# EAGLE design placa (EAGLE 9.2.2)
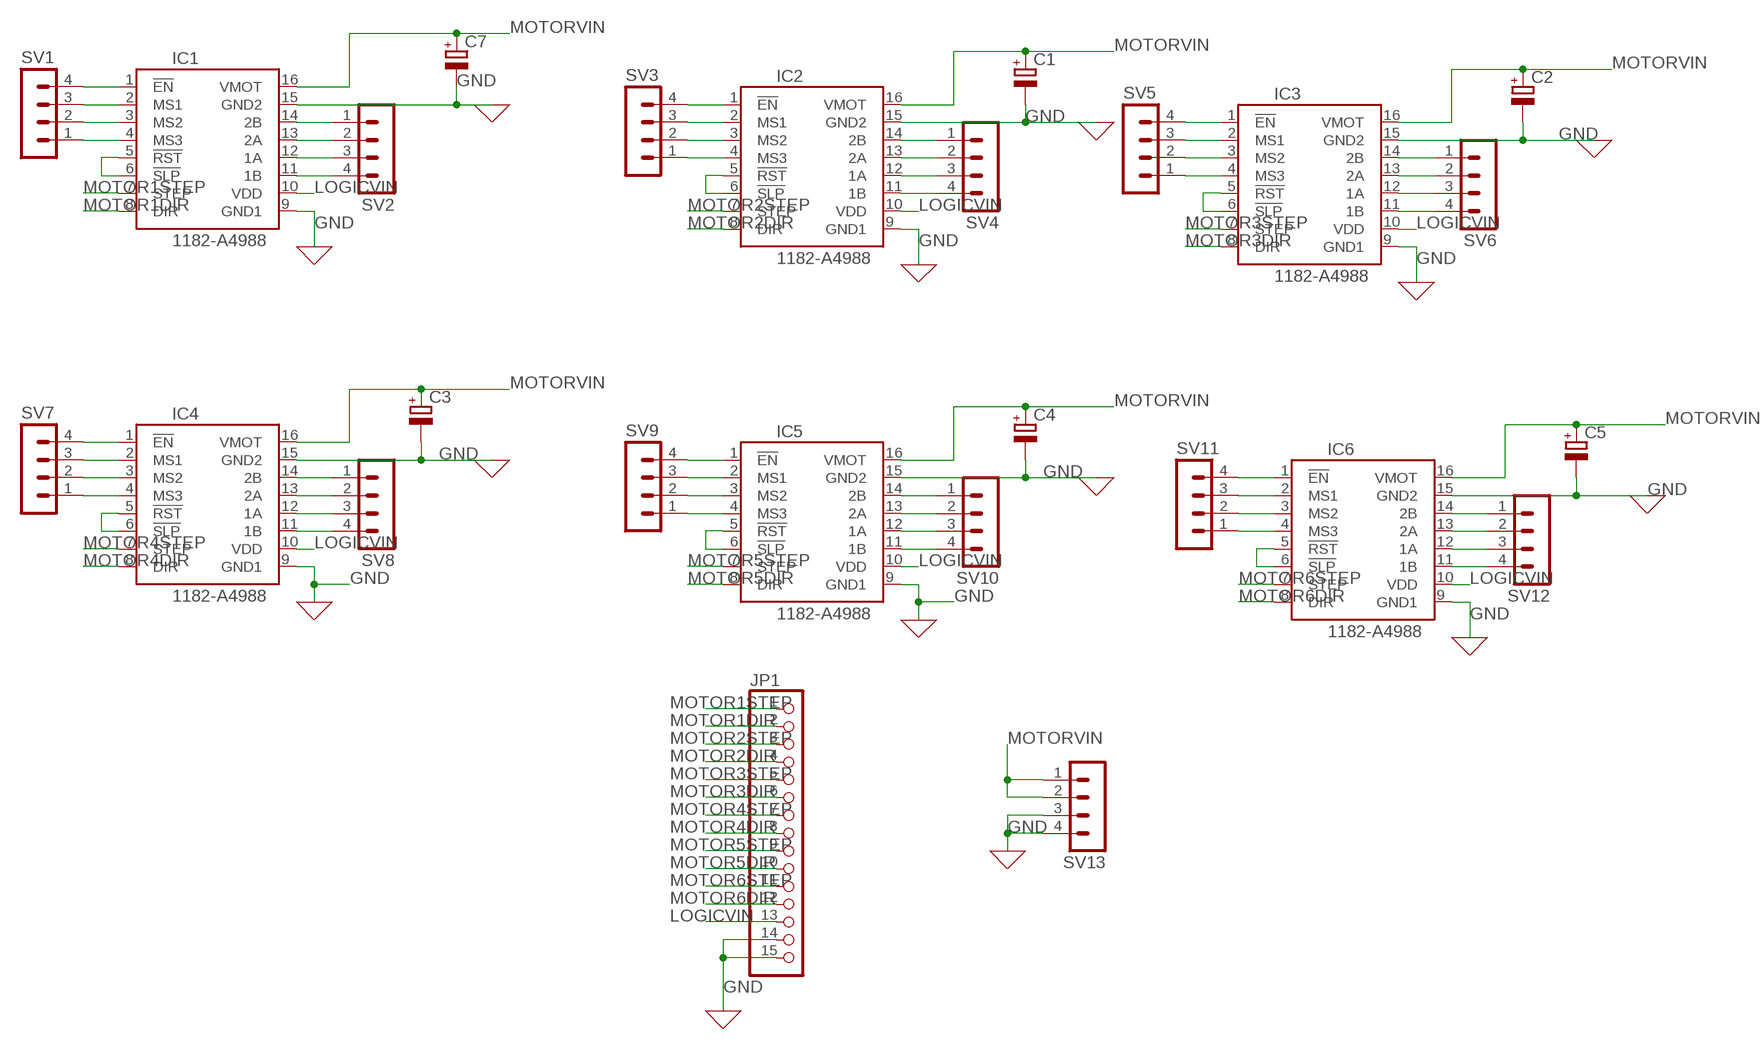
[diagram p0: schematic, sheet 1]

## Parts
C1  CPOL-EUE2.5-7  [E2,5-7]
C2  CPOL-EUE2.5-7  [E2,5-7]
C3  CPOL-EUE2.5-7  [E2,5-7]
C4  CPOL-EUE2.5-7  [E2,5-7]
C5  CPOL-EUE2.5-7  [E2,5-7]
C7  CPOL-EUE2.5-7  [E2,5-7]
IC1  1182-A4988  [A4988]
IC2  1182-A4988  [A4988]
IC3  1182-A4988  [A4988]
IC4  1182-A4988  [A4988]
IC5  1182-A4988  [A4988]
IC6  1182-A4988  [A4988]
JP1  PINHD-1X15  [1X15]
SV1  MA04-1  [MA04-1]
SV2  MA04-1  [MA04-1]
SV3  MA04-1  [MA04-1]
SV4  MA04-1  [MA04-1]
SV5  MA04-1  [MA04-1]
SV6  MA04-1  [MA04-1]
SV7  MA04-1  [MA04-1]
SV8  MA04-1  [MA04-1]
SV9  MA04-1  [MA04-1]
SV10  MA04-1  [MA04-1]
SV11  MA04-1  [MA04-1]
SV12  MA04-1  [MA04-1]
SV13  MA04-1  [MA04-1]

## Nets
GND: C1.- C2.- C3.- C4.- C5.- C7.- IC1.9(GND1) IC1.15(GND2) IC2.9(GND1) IC2.15(GND2) IC3.9(GND1) IC3.15(GND2) IC4.9(GND1) IC4.15(GND2) IC5.9(GND1) IC5.15(GND2) IC6.9(GND1) IC6.15(GND2) JP1.14 JP1.15 SV13.3 SV13.4
LOGICVIN: IC1.10(VDD) IC2.10(VDD) IC3.10(VDD) IC4.10(VDD) IC5.10(VDD) IC6.10(VDD) JP1.13
MOTOR1DIR: IC1.8(DIR) JP1.2
MOTOR1STEP: IC1.7(STEP) JP1.1
MOTOR2DIR: IC2.8(DIR) JP1.4
MOTOR2STEP: IC2.7(STEP) JP1.3
MOTOR3DIR: IC3.8(DIR) JP1.6
MOTOR3STEP: IC3.7(STEP) JP1.5
MOTOR4DIR: IC4.8(DIR) JP1.8
MOTOR4STEP: IC4.7(STEP) JP1.7
MOTOR5DIR: IC5.8(DIR) JP1.10
MOTOR5STEP: IC5.7(STEP) JP1.9
MOTOR6DIR: IC6.8(DIR) JP1.12
MOTOR6STEP: IC6.7(STEP) JP1.11
MOTORVIN: C1.+ C2.+ C3.+ C4.+ C5.+ C7.+ IC1.16(VMOT) IC2.16(VMOT) IC3.16(VMOT) IC4.16(VMOT) IC5.16(VMOT) IC6.16(VMOT) SV13.1 SV13.2
N$1: IC1.1(!EN) SV1.4
N$2: IC1.2(MS1) SV1.3
N$3: IC1.3(MS2) SV1.2
N$4: IC1.4(MS3) SV1.1
N$5: IC1.5(!RST) IC1.6(!SLP)
N$6: IC2.1(!EN) SV3.4
N$7: IC2.2(MS1) SV3.3
N$8: IC2.3(MS2) SV3.2
N$9: IC1.14(2B) SV2.1
N$10: IC1.13(2A) SV2.2
N$11: IC1.12(1A) SV2.3
N$12: IC1.11(1B) SV2.4
N$13: IC2.4(MS3) SV3.1
N$14: IC2.5(!RST) IC2.6(!SLP)
N$15: IC2.14(2B) SV4.1
N$16: IC2.13(2A) SV4.2
N$17: IC2.12(1A) SV4.3
N$18: IC2.11(1B) SV4.4
N$19: IC3.1(!EN) SV5.4
N$20: IC3.2(MS1) SV5.3
N$21: IC3.3(MS2) SV5.2
N$22: IC3.4(MS3) SV5.1
N$23: IC3.5(!RST) IC3.6(!SLP)
N$24: IC3.14(2B) SV6.1
N$25: IC3.13(2A) SV6.2
N$26: IC3.12(1A) SV6.3
N$27: IC3.11(1B) SV6.4
N$28: IC4.1(!EN) SV7.4
N$29: IC4.2(MS1) SV7.3
N$30: IC4.3(MS2) SV7.2
N$31: IC4.4(MS3) SV7.1
N$32: IC4.5(!RST) IC4.6(!SLP)
N$33: IC4.14(2B) SV8.1
N$34: IC4.13(2A) SV8.2
N$35: IC4.12(1A) SV8.3
N$36: IC4.11(1B) SV8.4
N$37: IC5.1(!EN) SV9.4
N$38: IC5.2(MS1) SV9.3
N$39: IC5.3(MS2) SV9.2
N$40: IC5.4(MS3) SV9.1
N$41: IC5.5(!RST) IC5.6(!SLP)
N$42: IC5.14(2B) SV10.1
N$43: IC5.13(2A) SV10.2
N$44: IC5.12(1A) SV10.3
N$45: IC5.11(1B) SV10.4
N$46: IC6.1(!EN) SV11.4
N$47: IC6.2(MS1) SV11.3
N$48: IC6.3(MS2) SV11.2
N$49: IC6.4(MS3) SV11.1
N$50: IC6.5(!RST) IC6.6(!SLP)
N$51: IC6.14(2B) SV12.1
N$52: IC6.13(2A) SV12.2
N$53: IC6.12(1A) SV12.3
N$54: IC6.11(1B) SV12.4

## Library data of the parts
C1-C5 C7 = rcl:CPOL-EU: POLARIZED CAPACITOR, European symbol; SPICEPREFIX: C
IC1-IC6 = pololu-stepper-driver:1182-A4988: A4988 Stepper Motor Driver Carrier #1182 A4988 Stepper Motor Driver Carrier <https://www.pololu.com/product/1182> in Japan, Suzaku Lab. Ltd. <https://suzakugiken.jp/> #1182 A4988ステッピングモータドライバ <https://szc.jp/po1182>
JP1 = pinhead:PINHD-1X15: PIN HEADER
SV1-SV13 = con-lstb:MA04-1: PIN HEADER; OC_FARNELL: unknown; OC_NEWARK: unknown

## Board
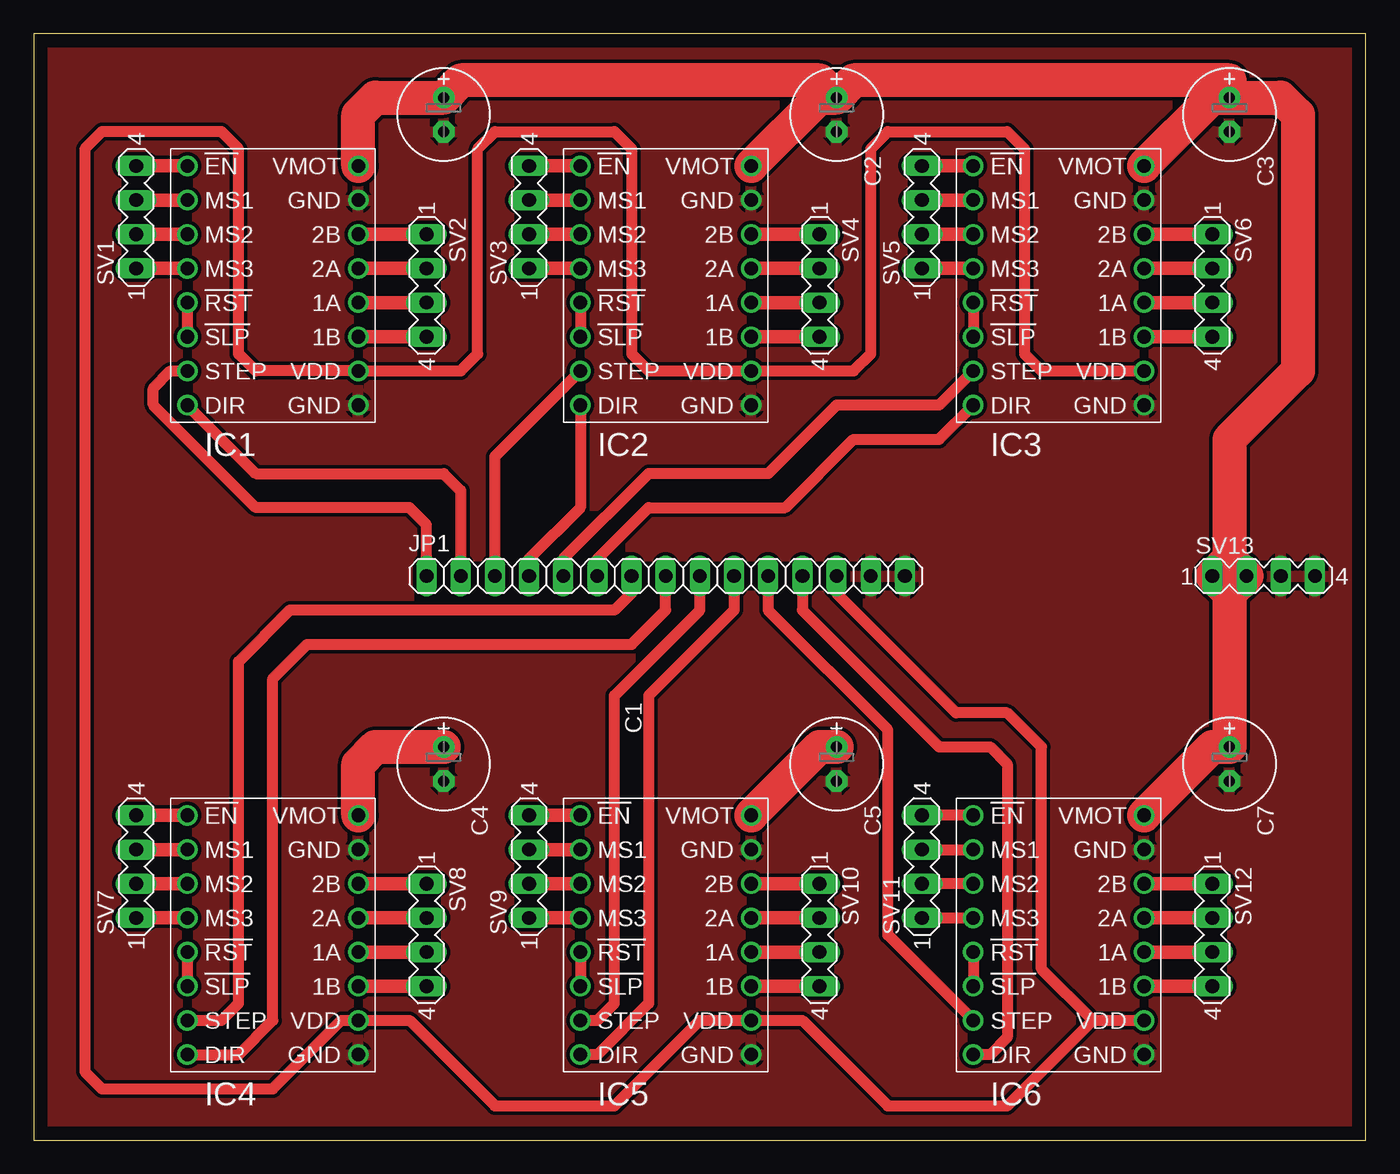
[diagram p1: board, top side]
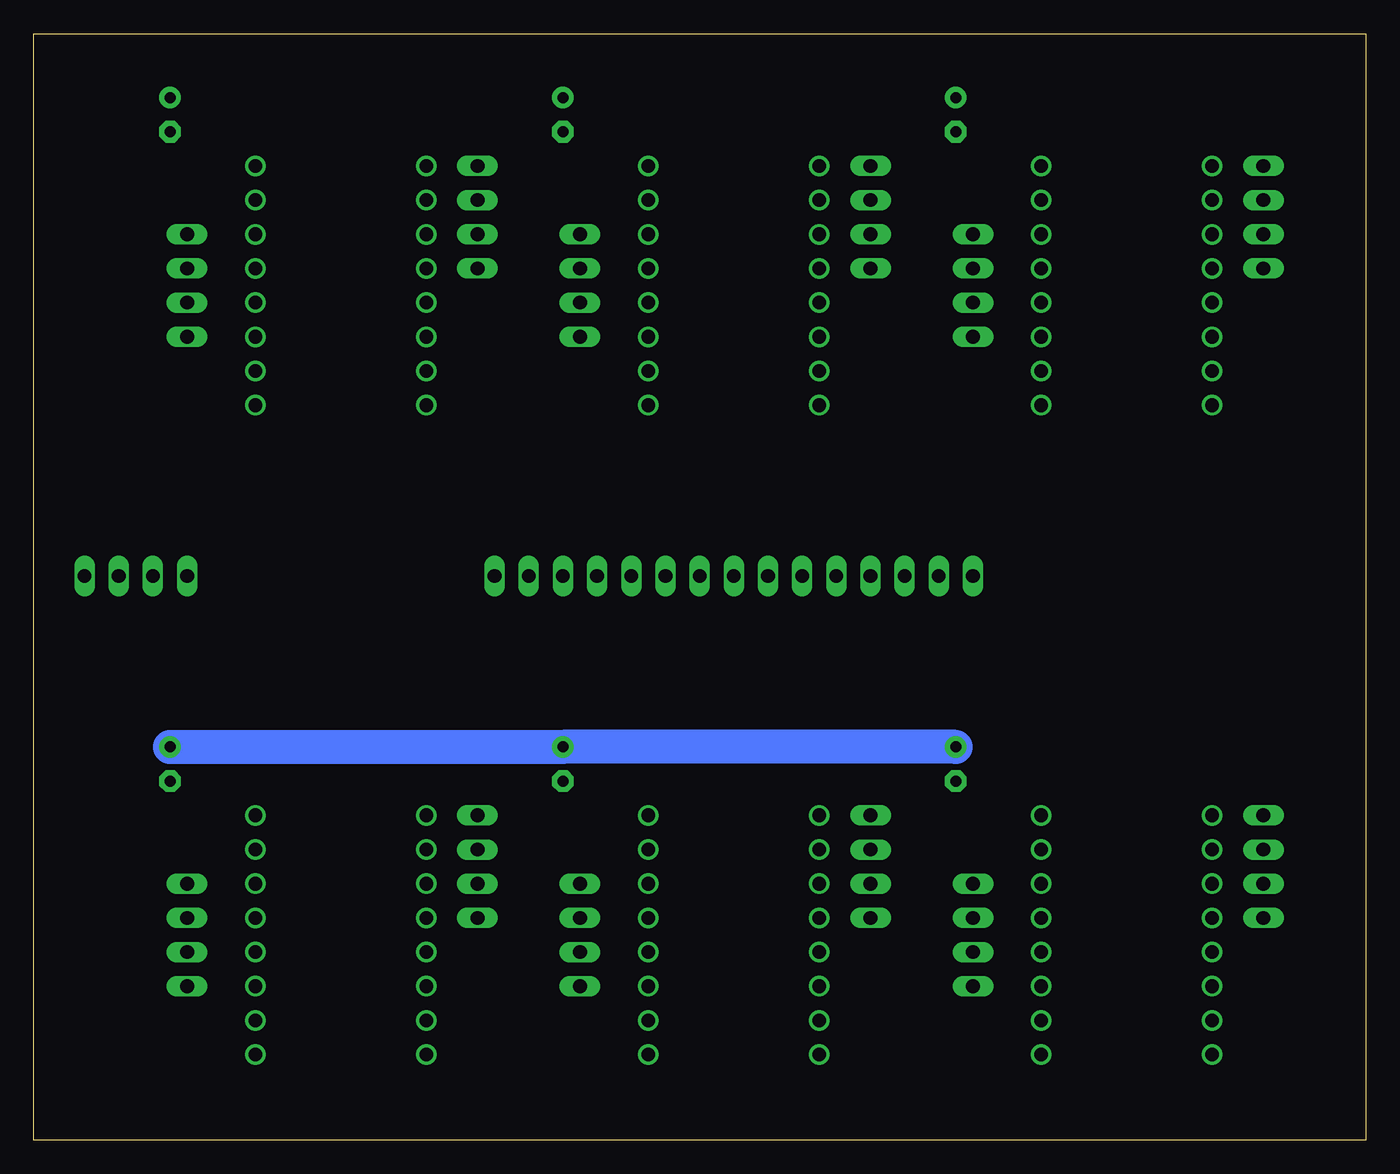
[diagram p2: board, bottom side, seen from below]

Size 99.04 x 82.22 mm. Coordinates in mm from the lower left corner, seen from the top.
Outline: 0,0 99.04,0 99.04,82.22 0,82.22 0,0
Copper layers (1*16): Top 0.035mm / dielectric 1.5mm / Bottom 0.035mm
Design rules "default": minimum track width 6mil, minimum drill 0.35mm, track to track 6mil, track to pad 6mil, pad to pad 6mil, via to via 6mil, smd to smd 6mil, copper to edge 40mil, drill to drill 6mil, minimum pad ring 10mil, minimum via ring 8mil, stop-mask expansion 4mil, vias tented up to drill 0mil, thermal gap 10mil

### Footprints (pad centres in the part's own frame; a part is rotated, then mirrored left to right if it is on the bottom)
E2,5-7 = drill 0.813 pad 1.6: + -1.27,0 | drill 0.813 pad 1.6 octagon: - 1.27,0
A4988 = drill 1.016: 1 -6.35,8.89; 2 -6.35,6.35; 3 -6.35,3.81; 4 -6.35,1.27; 5 -6.35,-1.27; 6 -6.35,-3.81; 7 -6.35,-6.35; 8 -6.35,-8.89; 9 6.35,-8.89; 10 6.35,-6.35; 11 6.35,-3.81; 12 6.35,-1.27; 13 6.35,1.27; 14 6.35,3.81; 15 6.35,6.35; 16 6.35,8.89
1X15 = drill 1.016 long: 1 -17.78,0; 2 -15.24,0; 3 -12.7,0; 4 -10.16,0; 5 -7.62,0; 6 -5.08,0; 7 -2.54,0; 8 0,0; 9 2.54,0; 10 5.08,0; 11 7.62,0; 12 10.16,0; 13 12.7,0; 14 15.24,0; 15 17.78,0
MA04-1 = drill 1.016 long: 1 -3.81,0; 2 -1.27,0; 3 1.27,0; 4 3.81,0

### Placement (x,y rotation side)
C1  30.48,76.2 270 top
C2  59.69,76.2 270 top
C3  88.9,76.2 270 top
C4  30.48,27.94 270 top
C5  59.69,27.94 270 top
C7  88.9,27.94 270 top
IC1  17.78,63.5 0 top
IC2  46.99,63.5 0 top
IC3  76.2,63.5 0 top
IC4  17.78,15.24 0 top
IC5  46.99,15.24 0 top
IC6  76.2,15.24 0 top
JP1  46.99,41.91 0 top
SV1  7.62,68.58 90 top
SV2  29.21,63.5 270 top
SV3  36.83,68.58 90 top
SV4  58.42,63.5 270 top
SV5  66.04,68.58 90 top
SV6  87.63,63.5 270 top
SV7  7.62,20.32 90 top
SV8  29.21,15.24 270 top
SV9  36.83,20.32 90 top
SV10  58.42,15.24 270 top
SV11  66.04,20.32 90 top
SV12  87.63,15.24 270 top
SV13  91.44,41.91 0 top

### Tracks (layer width: path | path; a pad name or v marks a point on that pad's centre or on a via)
GND
  pour Top (isolate 0.254): 0,82.55 99.06,82.55 99.06,0 0,0
LOGICVIN
  Top 0.813: IC3.10 74.93,57.15 73.66,58.42 73.66,73.66 72.39,74.93 63.5,74.93 62.23,73.66 62.23,58.42 60.96,57.15 IC2.10 45.72,57.15 44.45,58.42 44.45,73.66 43.18,74.93 34.29,74.93 33.02,73.66 33.02,58.42 31.75,57.15 IC1.10 16.51,57.15 15.24,58.42 15.24,73.66 13.97,74.93 5.08,74.93 3.81,73.66 3.81,5.08 5.08,3.81 17.78,3.81 22.86,8.89 IC4.10 27.94,8.89 34.29,2.54 43.18,2.54 49.53,8.89 IC5.10 57.15,8.89 63.5,2.54 72.39,2.54 78.74,8.89 | 78.74,8.89 IC6.10 | 78.74,8.89 74.93,12.7 74.93,29.21 72.39,31.75 68.58,31.75 59.69,40.64 JP1.13
MOTOR1DIR
  Top 0.813: IC1.8 16.51,49.53 30.48,49.53 31.75,48.26 JP1.2
MOTOR1STEP
  Top 0.813: JP1.1 29.21,45.72 27.94,46.99 16.51,46.99 8.89,54.61 8.89,55.88 10.16,57.15 IC1.7
MOTOR2DIR
  Top 0.813: IC2.8 40.64,46.99 36.83,43.18 JP1.4
MOTOR2STEP
  Top 0.813: IC2.7 34.29,50.8 JP1.3
MOTOR3DIR
  Top 0.813: JP1.6 41.91,43.18 45.72,46.99 55.88,46.99 60.96,52.07 67.31,52.07 IC3.8
MOTOR3STEP
  Top 0.813: IC3.7 67.31,54.61 59.69,54.61 54.61,49.53 45.72,49.53 39.37,43.18 JP1.5
MOTOR4DIR
  Top 0.813: IC4.8 15.24,6.35 17.78,8.89 17.78,34.29 20.32,36.83 44.45,36.83 46.99,39.37 JP1.8
MOTOR4STEP
  Top 0.813: JP1.7 44.45,40.64 43.18,39.37 19.05,39.37 15.24,35.56 15.24,10.16 13.97,8.89 IC4.7
MOTOR5DIR
  Top 0.813: JP1.10 52.07,39.37 45.72,33.02 45.72,10.16 41.91,6.35 IC5.8
MOTOR5STEP
  Top 0.813: IC5.7 41.91,8.89 43.18,10.16 43.18,33.02 49.53,39.37 JP1.9
MOTOR6DIR
  Top 0.813: JP1.12 57.15,39.37 67.31,29.21 71.12,29.21 72.39,27.94 72.39,7.62 71.12,6.35 IC6.8
MOTOR6STEP
  Top 0.813: IC6.7 63.5,15.24 63.5,30.48 54.61,39.37 JP1.11
MOTORVIN
  Top 2.54: C2.+ 58.42,78.74 31.75,78.74 C1.+ 25.4,77.47 24.13,76.2 IC1.16 | C2.+ 60.96,78.74 88.9,78.74 87.63,77.47 | 87.63,77.47 C3.+ 92.71,77.47 93.98,76.2 93.98,57.15 88.9,52.07 88.9,43.18 | IC2.16 58.42,77.47 C2.+ | IC3.16 87.63,77.47 | C4.+ 25.4,29.21 24.13,27.94 IC4.16 | IC5.16 58.42,29.21 C5.+ | IC6.16 87.63,29.21 C7.+ 88.9,40.64 | SV13.2 SV13.1 | SV13.1 88.9,40.64 | SV13.2 88.9,40.64 | 88.9,43.18 SV13.1 | SV13.2 88.9,43.18
  Bottom 2.54: C4.+ C5.+ C7.+
N$1
  Top 1.016: SV1.4 IC1.1
N$2
  Top 1.016: IC1.2 SV1.3
N$3
  Top 1.016: SV1.2 IC1.3
N$4
  Top 1.016: IC1.4 SV1.1
N$5
  Top 0.813: IC1.5 IC1.6
N$6
  Top 1.016: SV3.4 IC2.1
N$7
  Top 1.016: IC2.2 SV3.3
N$8
  Top 1.016: SV3.2 IC2.3
N$9
  Top 1.016: SV2.1 IC1.14
N$10
  Top 1.016: IC1.13 SV2.2
N$11
  Top 1.016: SV2.3 IC1.12
N$12
  Top 1.016: IC1.11 SV2.4
N$13
  Top 1.016: IC2.4 SV3.1
N$14
  Top 0.813: IC2.5 IC2.6
N$15
  Top 1.016: SV4.1 IC2.14
N$16
  Top 1.016: IC2.13 SV4.2
N$17
  Top 1.016: SV4.3 IC2.12
N$18
  Top 1.016: IC2.11 SV4.4
N$19
  Top 1.016: SV5.4 IC3.1
N$20
  Top 1.016: IC3.2 SV5.3
N$21
  Top 1.016: SV5.2 IC3.3
N$22
  Top 1.016: IC3.4 SV5.1
N$23
  Top 0.813: IC3.5 IC3.6
N$24
  Top 1.016: SV6.1 IC3.14
N$25
  Top 1.016: IC3.13 SV6.2
N$26
  Top 1.016: SV6.3 IC3.12
N$27
  Top 1.016: IC3.11 SV6.4
N$28
  Top 1.016: IC4.1 SV7.4
N$29
  Top 1.016: IC4.2 SV7.3
N$30
  Top 0.406: 6.35,19.05 SV7.2
  Top 1.016: IC4.3 SV7.2
N$31
  Top 1.016: IC4.4 SV7.1
N$32
  Top 0.813: IC4.5 IC4.6
N$33
  Top 1.016: SV8.1 IC4.14
N$34
  Top 1.016: SV8.2 IC4.13
N$35
  Top 1.016: SV8.3 IC4.12
N$36
  Top 1.016: SV8.4 IC4.11
N$37
  Top 1.016: SV9.4 IC5.1
N$38
  Top 1.016: IC5.2 SV9.3
N$39
  Top 1.016: SV9.2 IC5.3
N$40
  Top 1.016: IC5.4 SV9.1
N$41
  Top 0.813: IC5.5 IC5.6
N$42
  Top 1.016: SV10.1 IC5.14
N$43
  Top 1.016: SV10.2 IC5.13
N$44
  Top 1.016: SV10.3 IC5.12
N$45
  Top 1.016: SV10.4 IC5.11
N$46
  Top 0.813: IC6.1 SV11.4
N$47
  Top 0.813: SV11.3 IC6.2
N$48
  Top 0.813: IC6.3 SV11.2
N$49
  Top 0.813: SV11.1 IC6.4
N$50
  Top 0.813: IC6.5 IC6.6
N$51
  Top 1.016: IC6.14 SV12.1
N$52
  Top 1.016: SV12.2 IC6.13
N$53
  Top 1.016: IC6.12 SV12.3
N$54
  Top 1.016: SV12.4 IC6.11